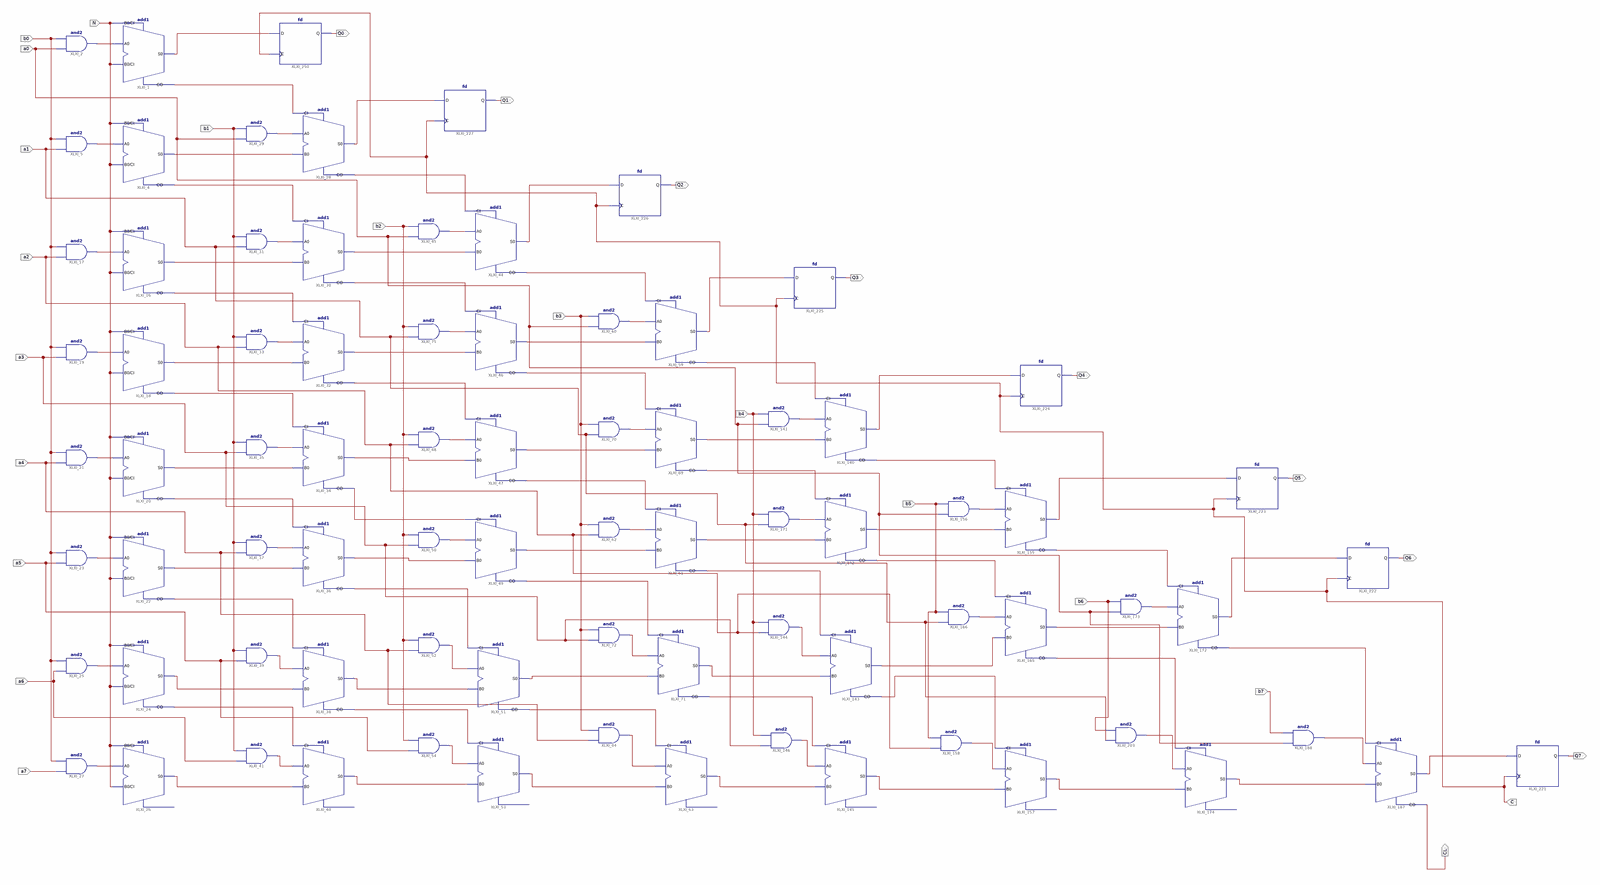
[diagram p0: schematic sheet 1, whole]
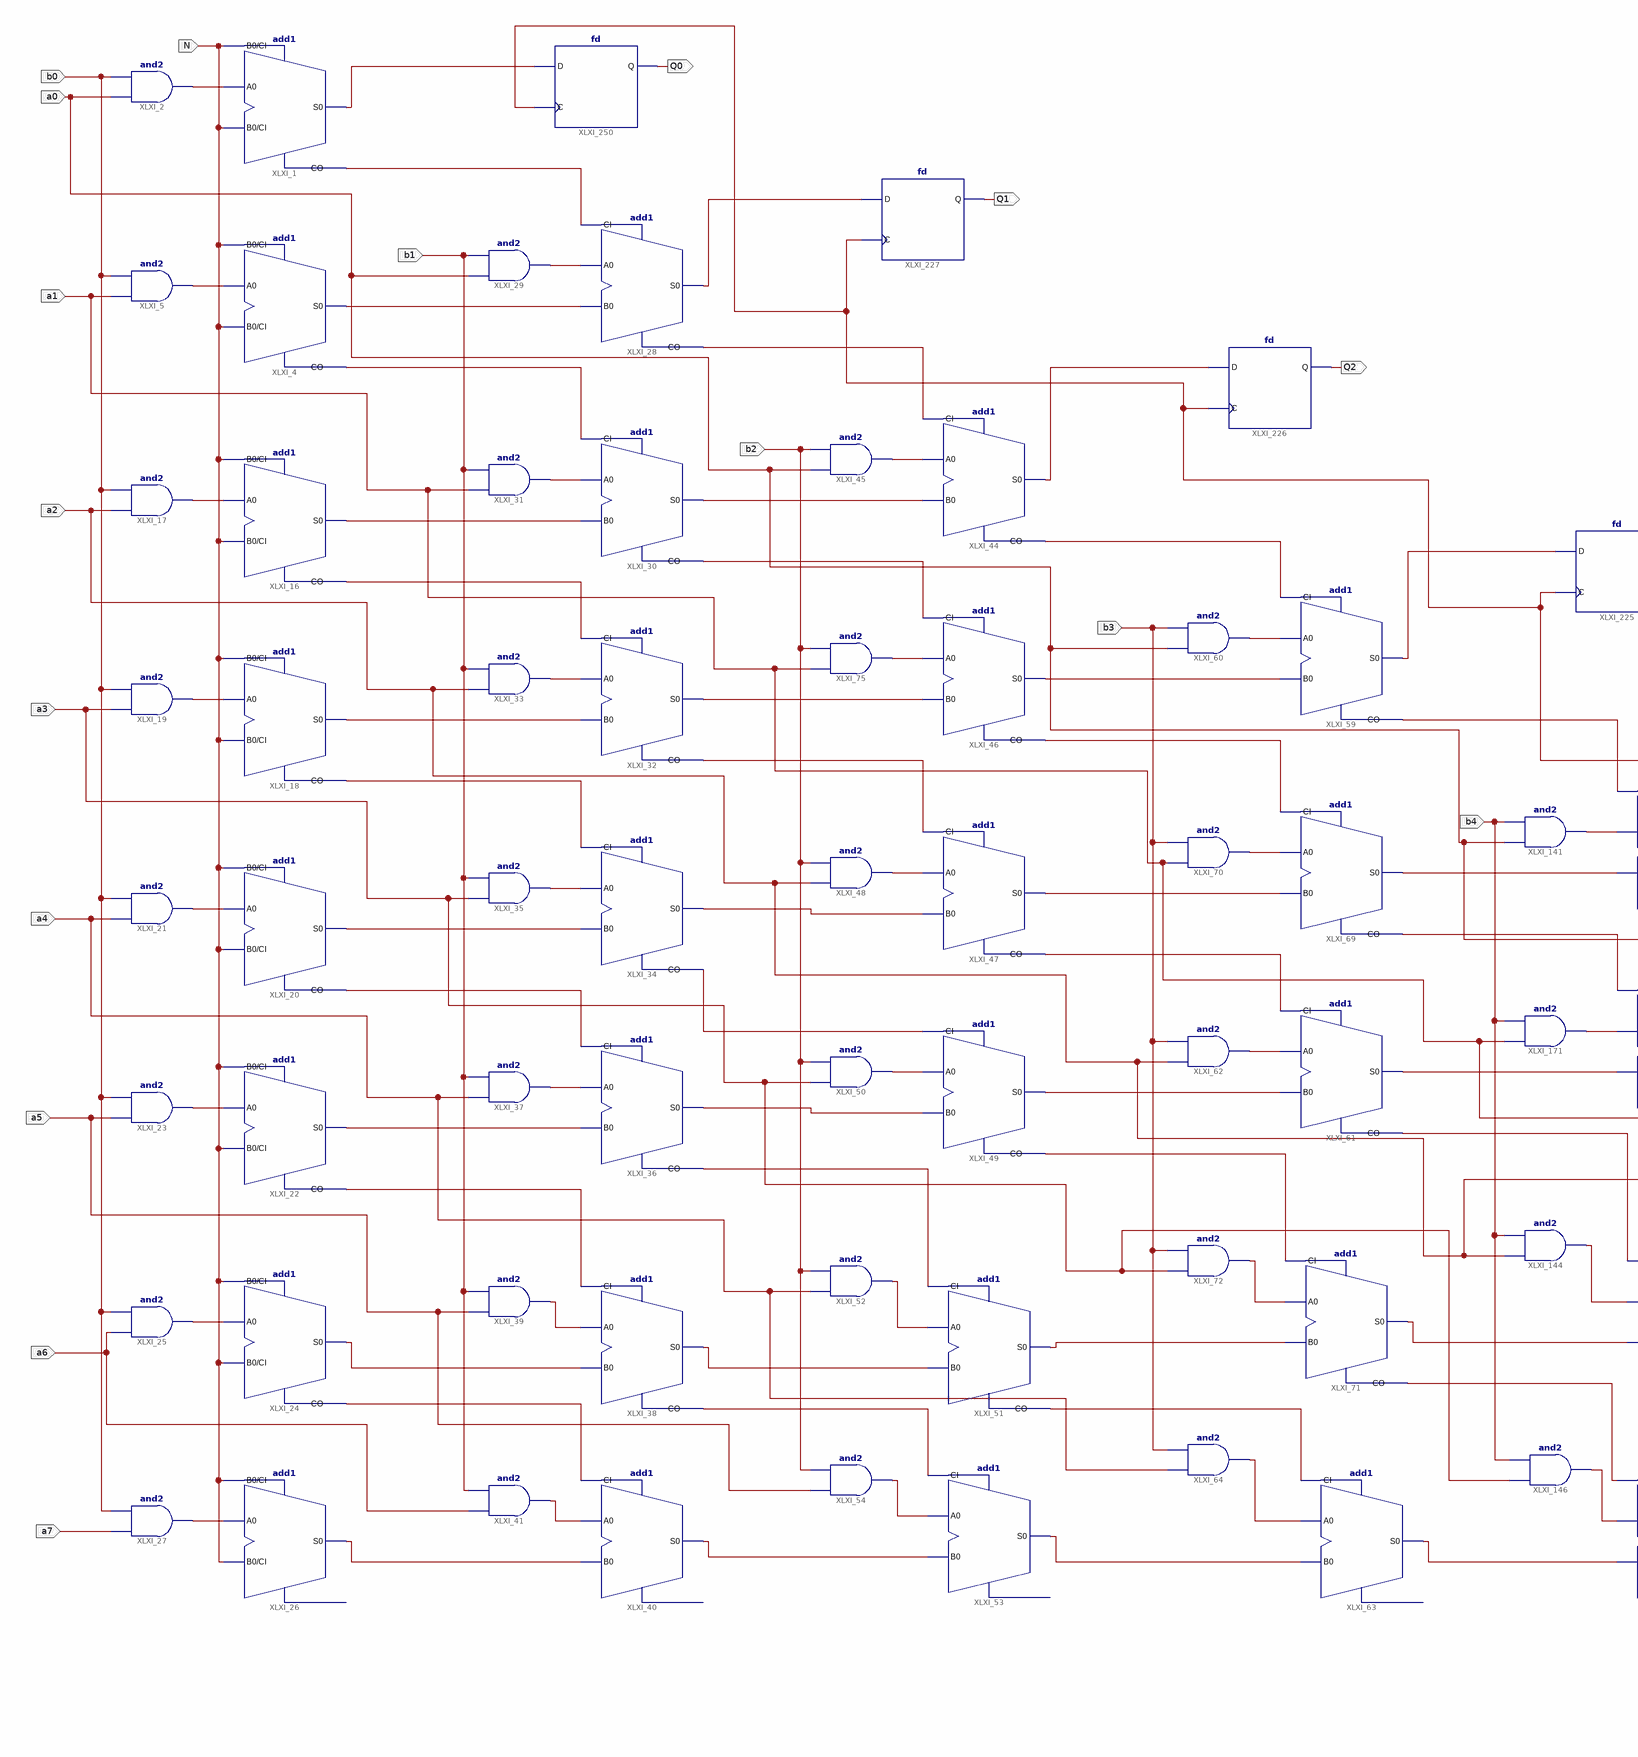
[diagram p1: schematic sheet 1, left part]
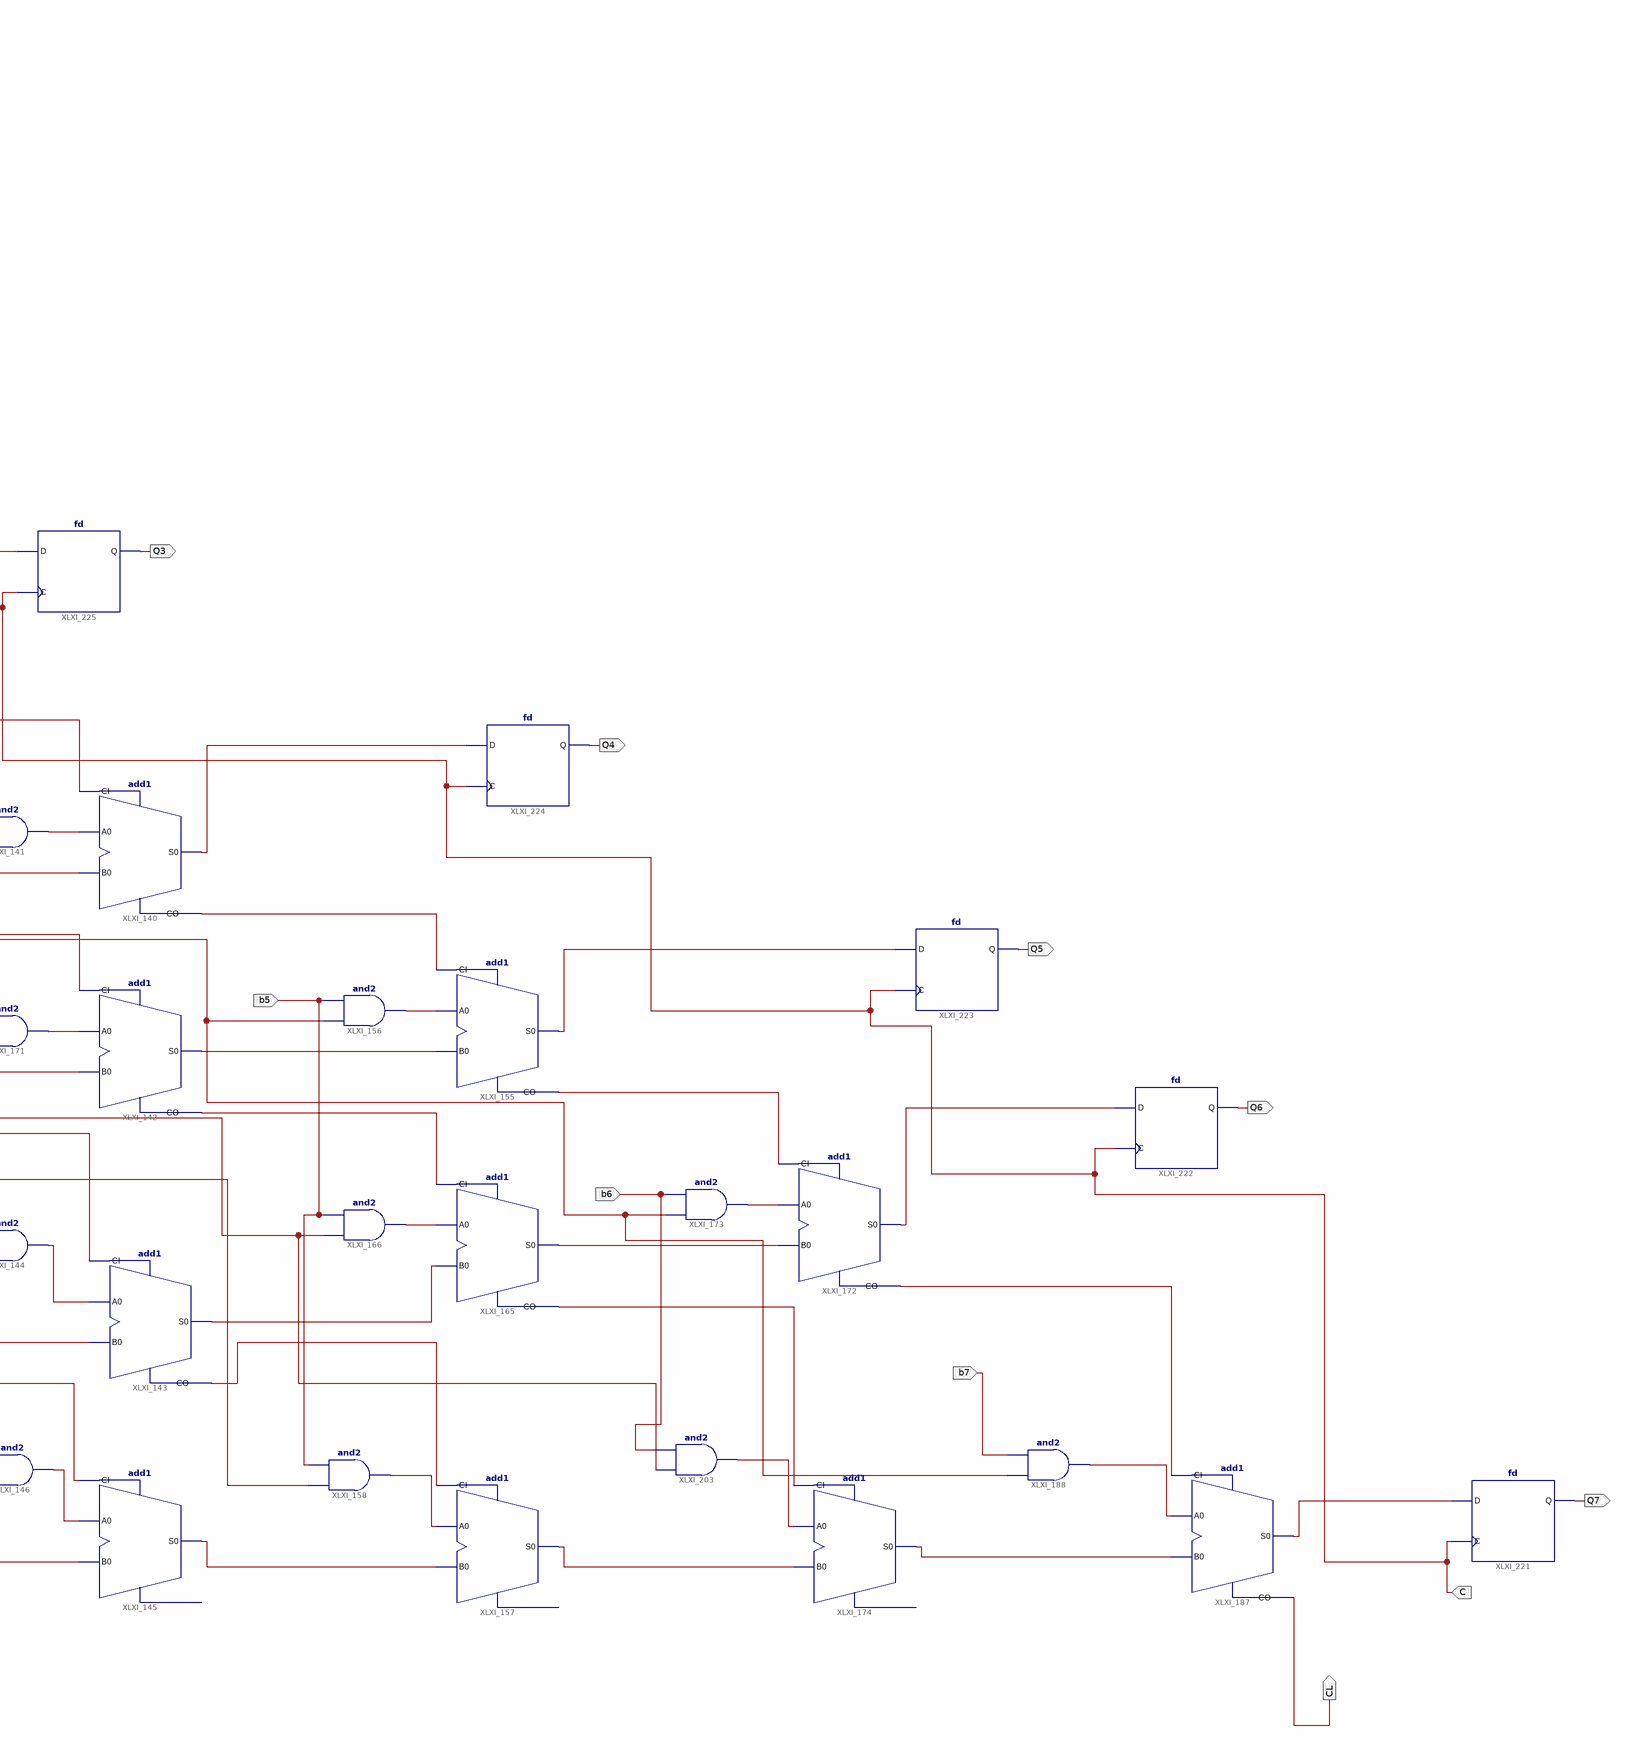
[diagram p2: schematic sheet 1, right part]
// Xilinx ISE schematic scheme.sch (xc9500xl) as structural Verilog: 80 symbols, 27 ports
module scheme (
  input  b0,
  input  a0,
  input  a7,
  input  N,
  input  b1,
  input  b2,
  input  a6,
  input  a5,
  input  a4,
  input  b3,
  input  b4,
  input  a3,
  input  a2,
  input  a1,
  input  b5,
  input  b6,
  input  b7,
  input  C,
  output Q2,
  output Q1,
  output Q0,
  output Q3,
  output Q4,
  output Q5,
  output Q6,
  output Q7,
  output CL
);

  wire XLXN_12, XLXN_13, XLXN_14, XLXN_15, XLXN_16, XLXN_17, XLXN_36, XLXN_37, XLXN_38, XLXN_39, XLXN_40,
       XLXN_41, XLXN_42, XLXN_43, XLXN_44, XLXN_45, XLXN_46, XLXN_56, XLXN_57, XLXN_59, XLXN_63, XLXN_64,
       XLXN_65, XLXN_66, XLXN_70, XLXN_71, XLXN_85, XLXN_86, XLXN_87, XLXN_88, XLXN_89, XLXN_90, XLXN_94,
       XLXN_95, XLXN_96, XLXN_97, XLXN_98, XLXN_99, XLXN_100, XLXN_101, XLXN_102, XLXN_103, XLXN_104,
       XLXN_105, XLXN_106, XLXN_107, XLXN_108, XLXN_116, XLXN_117, XLXN_118, XLXN_119, XLXN_120, XLXN_121,
       XLXN_122, XLXN_123, XLXN_124, XLXN_125, XLXN_126, XLXN_127, XLXN_232, XLXN_233, XLXN_234, XLXN_235,
       XLXN_240, XLXN_241, XLXN_242, XLXN_243, XLXN_244, XLXN_245, XLXN_246, XLXN_247, XLXN_248, XLXN_268,
       XLXN_269, XLXN_275, XLXN_276, XLXN_277, XLXN_294, XLXN_295, XLXN_296, XLXN_297, XLXN_309, XLXN_310,
       XLXN_311, XLXN_312, XLXN_313, XLXN_314, XLXN_315, XLXN_316, XLXN_370, XLXN_379, XLXN_380, XLXN_381,
       XLXN_382, XLXN_383, XLXN_384, XLXN_385, XLXN_529, XLXN_530, XLXN_531;

  and XLXI_2 (XLXN_530, a0, b0);
  and XLXI_5 (XLXN_17, a1, b0);
  and XLXI_17 (XLXN_16, a2, b0);
  and XLXI_19 (XLXN_15, a3, b0);
  and XLXI_21 (XLXN_14, a4, b0);
  and XLXI_23 (XLXN_13, a5, b0);
  and XLXI_25 (XLXN_12, a6, b0);
  and XLXI_27 (XLXN_531, a7, b0);
  add1 XLXI_28 (.A0(XLXN_42), .B0(XLXN_44), .CI(XLXN_43), .CO(XLXN_116), .S0(XLXN_384));
  and XLXI_29 (XLXN_42, a0, b1);
  add1 XLXI_30 (.A0(XLXN_41), .B0(XLXN_46), .CI(XLXN_45), .CO(XLXN_118), .S0(XLXN_117));
  and XLXI_31 (XLXN_41, a1, b1);
  add1 XLXI_32 (.A0(XLXN_40), .B0(XLXN_57), .CI(XLXN_56), .CO(XLXN_120), .S0(XLXN_119));
  and XLXI_33 (XLXN_40, a2, b1);
  add1 XLXI_34 (.A0(XLXN_39), .B0(XLXN_59), .CI(XLXN_529), .CO(XLXN_122), .S0(XLXN_121));
  and XLXI_35 (XLXN_39, a3, b1);
  add1 XLXI_36 (.A0(XLXN_38), .B0(XLXN_64), .CI(XLXN_63), .CO(XLXN_124), .S0(XLXN_123));
  and XLXI_37 (XLXN_38, a4, b1);
  add1 XLXI_38 (.A0(XLXN_37), .B0(XLXN_66), .CI(XLXN_65), .CO(XLXN_126), .S0(XLXN_125));
  and XLXI_39 (XLXN_37, a5, b1);
  add1 XLXI_44 (.A0(XLXN_90), .B0(XLXN_117), .CI(XLXN_116), .CO(XLXN_97), .S0(XLXN_383));
  and XLXI_45 (XLXN_90, a0, b2);
  add1 XLXI_46 (.A0(XLXN_89), .B0(XLXN_119), .CI(XLXN_118), .CO(XLXN_99), .S0(XLXN_98));
  add1 XLXI_47 (.A0(XLXN_88), .B0(XLXN_121), .CI(XLXN_120), .CO(XLXN_102), .S0(XLXN_100));
  and XLXI_48 (XLXN_88, a2, b2);
  add1 XLXI_49 (.A0(XLXN_87), .B0(XLXN_123), .CI(XLXN_122), .CO(XLXN_104), .S0(XLXN_103));
  and XLXI_50 (XLXN_87, a3, b2);
  add1 XLXI_51 (.A0(XLXN_86), .B0(XLXN_125), .CI(XLXN_124), .CO(XLXN_107), .S0(XLXN_105));
  and XLXI_52 (XLXN_86, a4, b2);
  add1 XLXI_53 (.A0(XLXN_85), .B0(XLXN_127), .CI(XLXN_126), .S0(XLXN_108));  // open: CO
  and XLXI_54 (XLXN_85, a5, b2);
  add1 XLXI_59 (.A0(XLXN_96), .B0(XLXN_98), .CI(XLXN_97), .CO(XLXN_309), .S0(XLXN_382));
  and XLXI_60 (XLXN_96, a0, b3);
  add1 XLXI_61 (.A0(XLXN_95), .B0(XLXN_103), .CI(XLXN_102), .CO(XLXN_313), .S0(XLXN_312));
  and XLXI_62 (XLXN_95, a2, b3);
  add1 XLXI_63 (.A0(XLXN_94), .B0(XLXN_108), .CI(XLXN_107), .S0(XLXN_316));  // open: CO
  and XLXI_64 (XLXN_94, a4, b3);
  add1 XLXI_69 (.A0(XLXN_101), .B0(XLXN_100), .CI(XLXN_99), .CO(XLXN_311), .S0(XLXN_310));
  and XLXI_70 (XLXN_101, a1, b3);
  add1 XLXI_71 (.A0(XLXN_106), .B0(XLXN_105), .CI(XLXN_104), .CO(XLXN_315), .S0(XLXN_314));
  and XLXI_72 (XLXN_106, a3, b3);
  and XLXI_75 (XLXN_89, a1, b2);
  add1 XLXI_140 (.A0(XLXN_235), .B0(XLXN_310), .CI(XLXN_309), .CO(XLXN_242), .S0(XLXN_381));
  and XLXI_141 (XLXN_235, a0, b4);
  add1 XLXI_142 (.A0(XLXN_234), .B0(XLXN_312), .CI(XLXN_311), .CO(XLXN_244), .S0(XLXN_243));
  add1 XLXI_143 (.A0(XLXN_233), .B0(XLXN_314), .CI(XLXN_313), .CO(XLXN_247), .S0(XLXN_245));
  and XLXI_144 (XLXN_233, a2, b4);
  add1 XLXI_145 (.A0(XLXN_232), .B0(XLXN_316), .CI(XLXN_315), .S0(XLXN_248));  // open: CO
  and XLXI_146 (XLXN_232, a3, b4);
  add1 XLXI_155 (.A0(XLXN_241), .B0(XLXN_243), .CI(XLXN_242), .CO(XLXN_294), .S0(XLXN_380));
  and XLXI_156 (XLXN_241, a0, b5);
  add1 XLXI_157 (.A0(XLXN_240), .B0(XLXN_248), .CI(XLXN_247), .S0(XLXN_297));  // open: CO
  and XLXI_158 (XLXN_240, a2, b5);
  add1 XLXI_165 (.A0(XLXN_246), .B0(XLXN_245), .CI(XLXN_244), .CO(XLXN_296), .S0(XLXN_295));
  and XLXI_166 (XLXN_246, a1, b5);
  and XLXI_171 (XLXN_234, a1, b4);
  add1 XLXI_172 (.A0(XLXN_269), .B0(XLXN_295), .CI(XLXN_294), .CO(XLXN_276), .S0(XLXN_379));
  and XLXI_173 (XLXN_269, a0, b6);
  add1 XLXI_174 (.A0(XLXN_268), .B0(XLXN_297), .CI(XLXN_296), .S0(XLXN_277));  // open: CO
  add1 XLXI_187 (.A0(XLXN_275), .B0(XLXN_277), .CI(XLXN_276), .CO(CL), .S0(XLXN_370));
  and XLXI_188 (XLXN_275, a0, b7);
  and XLXI_203 (XLXN_268, a1, b6);
  fd XLXI_226 (.C(C), .D(XLXN_383), .Q(Q2));
  fd XLXI_227 (.C(C), .D(XLXN_384), .Q(Q1));
  fd XLXI_250 (.C(C), .D(XLXN_385), .Q(Q0));
  fd XLXI_225 (.C(C), .D(XLXN_382), .Q(Q3));
  fd XLXI_224 (.C(C), .D(XLXN_381), .Q(Q4));
  fd XLXI_223 (.C(C), .D(XLXN_380), .Q(Q5));
  fd XLXI_222 (.C(C), .D(XLXN_379), .Q(Q6));
  add1 XLXI_26 (.A0(XLXN_531), .B0(N), .CI(N), .S0(XLXN_71));  // open: CO
  add1 XLXI_24 (.A0(XLXN_12), .B0(N), .CI(N), .CO(XLXN_70), .S0(XLXN_66));
  add1 XLXI_22 (.A0(XLXN_13), .B0(N), .CI(N), .CO(XLXN_65), .S0(XLXN_64));
  add1 XLXI_20 (.A0(XLXN_14), .B0(N), .CI(N), .CO(XLXN_63), .S0(XLXN_59));
  add1 XLXI_18 (.A0(XLXN_15), .B0(N), .CI(N), .CO(XLXN_529), .S0(XLXN_57));
  add1 XLXI_16 (.A0(XLXN_16), .B0(N), .CI(N), .CO(XLXN_56), .S0(XLXN_46));
  add1 XLXI_4 (.A0(XLXN_17), .B0(N), .CI(N), .CO(XLXN_45), .S0(XLXN_44));
  add1 XLXI_1 (.A0(XLXN_530), .B0(N), .CI(N), .CO(XLXN_43), .S0(XLXN_385));
  add1 XLXI_40 (.A0(XLXN_36), .B0(XLXN_71), .CI(XLXN_70), .S0(XLXN_127));  // open: CO
  and XLXI_41 (XLXN_36, a6, b1);
  fd XLXI_221 (.C(C), .D(XLXN_370), .Q(Q7));
endmodule
